# Altium project teclado.PrjPcb (part 1 of 3)
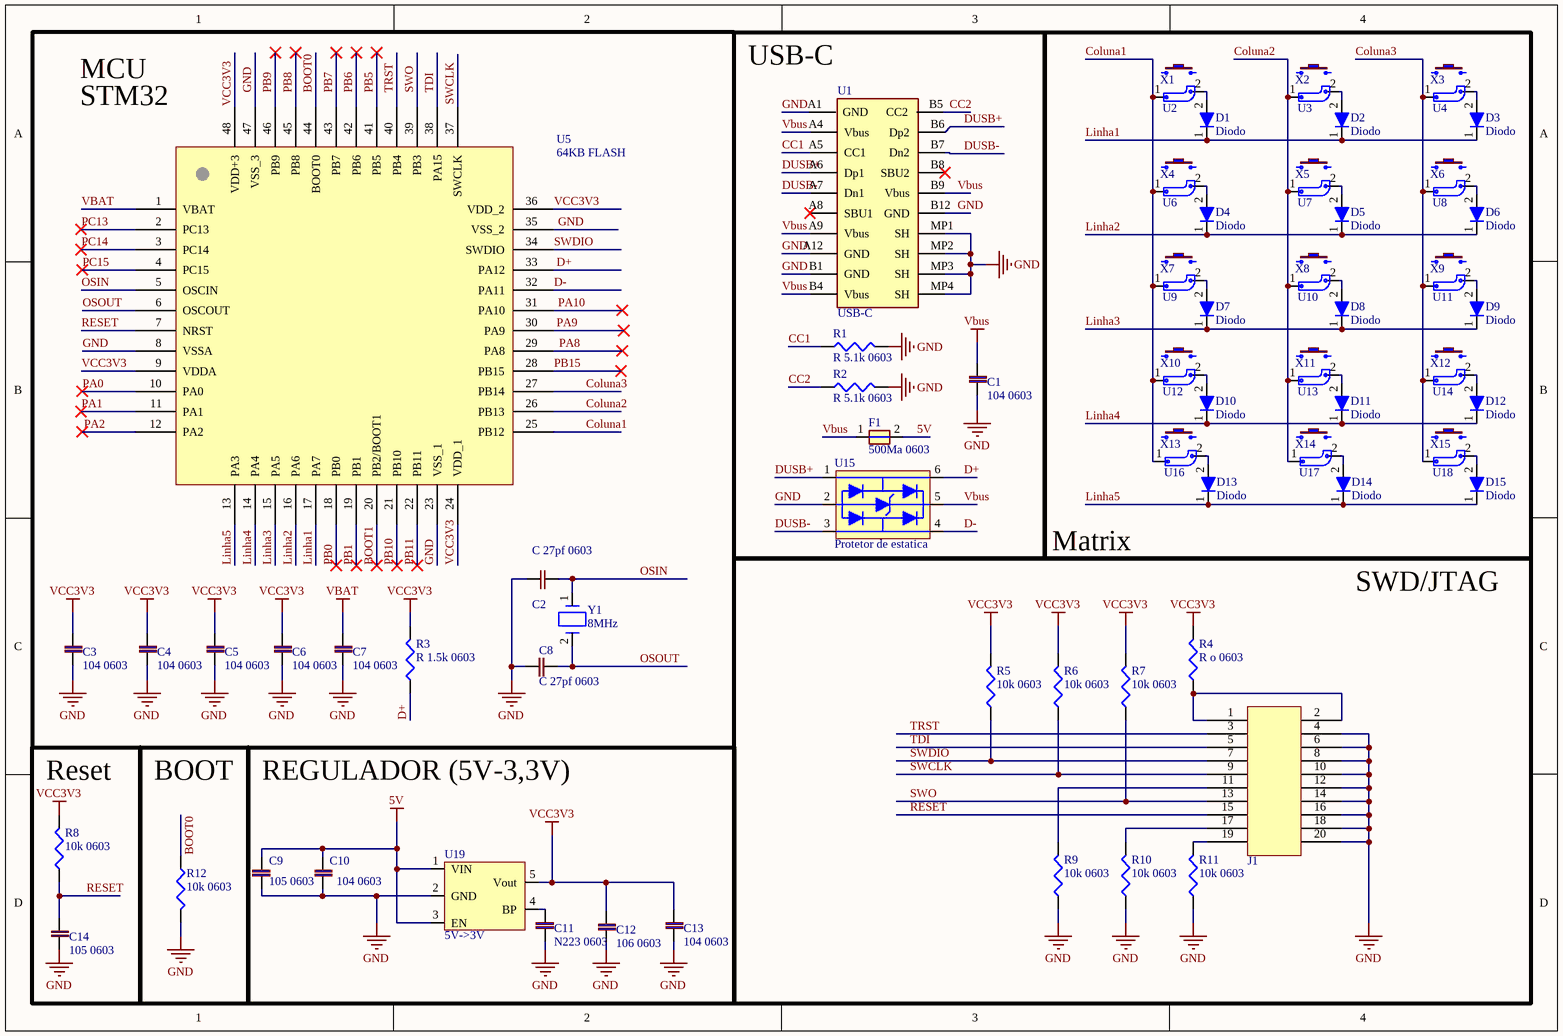
[diagram p0: SqTeclado.SchDoc]
1 sheet, 78 parts. Net scope: global (net labels, ports and power ports of the same name join across sheets).
Board file: PCBtc.PcbDoc

## Sheet SqTeclado.SchDoc
size A4; SheetNumber: 1; SheetTotal: 1

### Parts
C1  104 0603  [Cap 104 0603]
C2  C 27pf 0603  [c 27pf 0603]
C3  104 0603  [Cap 104 0603]
C4  104 0603  [Cap 104 0603]
C5  104 0603  [Cap 104 0603]
C6  104 0603  [Cap 104 0603]
C7  104 0603  [Cap 104 0603]
C8  C 27pf 0603  [c 27pf 0603]
C9  105 0603  [cap 105 0603]
C10  104 0603  [Cap 104 0603]
C11  N223 0603  [cap 223 0603]
C12  106 0603  [cap 106 0603]
C13  104 0603  [Cap 104 0603]
C14  105 0603  [cap 105 0603]
D1  Diodo  [Diodo C]
D2  Diodo  [Diodo C]
D3  Diodo  [Diodo C]
D4  Diodo  [Diodo C]
D5  Diodo  [Diodo C]
D6  Diodo  [Diodo C]
D7  Diodo  [Diodo C]
D8  Diodo  [Diodo C]
D9  Diodo  [Diodo C]
D10  Diodo  [Diodo C]
D11  Diodo  [Diodo C]
D12  Diodo  [Diodo C]
D13  Diodo  [Diodo C]
D14  Diodo  [Diodo C]
D15  Diodo  [Diodo C]
F1  500Ma 0603  [F 500ma 0603]
J1  70247-2051  [Conector 20 pinos angulado p/ programação]  (value not drawn)
R1  R 5.1k 0603  [R 5.1k 0603]
R2  R 5.1k 0603  [R 5.1k 0603]
R3  R 1.5k 0603  [R 1.5k 0603]
R4  R o 0603  [R 0 0603]
R5  10k 0603  [Resistor 10k 0603]
R6  10k 0603  [Resistor 10k 0603]
R7  10k 0603  [Resistor 10k 0603]
R8  10k 0603  [Resistor 10k 0603]
R9  10k 0603  [Resistor 10k 0603]
R10  10k 0603  [Resistor 10k 0603]
R11  10k 0603  [Resistor 10k 0603]
R12  10k 0603  [Resistor 10k 0603]
U1  USB-C  [USB-C]
U2  suporte hot-swap  [Suporte Hot-Swap]  (value not drawn)
U3  suporte hot-swap  [Suporte Hot-Swap]  (value not drawn)
U4  suporte hot-swap  [Suporte Hot-Swap]  (value not drawn)
U5  64KB FLASH  [STM32F103C8T6]
U6  suporte hot-swap  [Suporte Hot-Swap]  (value not drawn)
U7  suporte hot-swap  [Suporte Hot-Swap]  (value not drawn)
U8  suporte hot-swap  [Suporte Hot-Swap]  (value not drawn)
U9  suporte hot-swap  [Suporte Hot-Swap]  (value not drawn)
U10  suporte hot-swap  [Suporte Hot-Swap]  (value not drawn)
U11  suporte hot-swap  [Suporte Hot-Swap]  (value not drawn)
U12  suporte hot-swap  [Suporte Hot-Swap]  (value not drawn)
U13  suporte hot-swap  [Suporte Hot-Swap]  (value not drawn)
U14  suporte hot-swap  [Suporte Hot-Swap]  (value not drawn)
U15  Protetor de estatica  [Potege estatica]
U16  suporte hot-swap  [Suporte Hot-Swap]  (value not drawn)
U17  suporte hot-swap  [Suporte Hot-Swap]  (value not drawn)
U18  suporte hot-swap  [Suporte Hot-Swap]  (value not drawn)
U19  5V->3V  [Regulador 5v->3v]
X1  switch  [tecla]  (value not drawn)
X2  switch  [tecla]  (value not drawn)
X3  switch  [tecla]  (value not drawn)
X4  switch  [tecla]  (value not drawn)
X5  switch  [tecla]  (value not drawn)
X6  switch  [tecla]  (value not drawn)
X7  switch  [tecla]  (value not drawn)
X8  switch  [tecla]  (value not drawn)
X9  switch  [tecla]  (value not drawn)
X10  switch  [tecla]  (value not drawn)
X11  switch  [tecla]  (value not drawn)
X12  switch  [tecla]  (value not drawn)
X13  switch  [tecla]  (value not drawn)
X14  switch  [tecla]  (value not drawn)
X15  switch  [tecla]  (value not drawn)
Y1  8MHz  [Cristal 8MHz]

### Blocks framed on the sheet
USB-C: C1 F1 R1 R2 U1 U15
Matrix: D1-D15 U2-U4 U6-U14 U16-U18 X1-X15
SWD/JTAG: J1 R4-R7 R9-R11
Reset: C14 R8
BOOT: R12
REGULADOR (5V-3,3V): C9-C13 U19

### Nets
5V: C9.1 C10.2 F1.2 U19.1(VIN) U19.3(EN)
GND: C1.1 C2.1 C3.1 C4.1 C5.1 C6.1 C7.1 C8.1 C9.2 C10.1 C11.2 C12.1 C13.1 C14.1 J1.4 J1.6 J1.8 J1.10 J1.12 J1.14 J1.16 J1.18 J1.20 R1.2 R2.2 R9.1 R10.1 R11.1 R12.2 U1.A1(GND) U1.A12(GND) U1.B1(GND) U1.B12(GND) U1.MP1(SH) U1.MP2(SH) U1.MP3(SH) U1.MP4(SH) U5.8(VSSA) U5.23(VSS_1) U5.35(VSS_2) U5.47(VSS_3) U15.2 U19.2(GND)
VBAT: C7.2 U5.1(VBAT)
Vbus: C1.2 F1.1 U1.A4(Vbus) U1.A9(Vbus) U1.B4(Vbus) U1.B9(Vbus) U15.5
VCC3V3: C3.2 C4.2 C5.2 C6.2 C12.2 C13.2 R3.2 R4.2 R5.2 R6.2 R7.2 R8.2 U5.9(VDDA) U5.24(VDD_1) U5.36(VDD_2) U5.48(VDD+3) U19.5(Vout)
BOOT0: R12.1 U5.44(BOOT0)
BOOT1: U5.20(PB2/BOOT1)
CC1: R1.1 U1.A5(CC1)
CC2: R2.1 U1.B5(CC2)
Coluna1: U2.1 U5.25(PB12) U6.1 U9.1 U12.1 U16.1
Coluna2: U3.1 U5.26(PB13) U7.1 U10.1 U13.1 U17.1
Coluna3: U4.1 U5.27(PB14) U8.1 U11.1 U14.1 U18.1
D+: R3.1 U5.33(PA12) U15.6
D-: U5.32(PA11) U15.4
DUSB+: U1.A6(Dp1) U1.B6(Dp2) U15.1
DUSB-: U1.A7(Dn1) U1.B7(Dn2) U15.3
Linha1: D1.1 D2.1 D3.1 U5.17(PA7)
Linha2: D4.1 D5.1 D6.1 U5.16(PA6)
Linha3: D7.1 D8.1 D9.1 U5.15(PA5)
Linha4: D10.1 D11.1 D12.1 U5.14(PA4)
Linha5: D13.1 D14.1 D15.1 U5.13(PA3)
OSIN: C2.2 U5.5(OSCIN) Y1.1
OSOUT: C8.2 U5.6(OSCOUT) Y1.2
PA0: U5.10(PA0)
PA1: U5.11(PA1)
PA2: U5.12(PA2)
PA8: U5.29(PA8)
PA9: U5.30(PA9)
PA10: U5.31(PA10)
PB0: U5.18(PB0)
PB1: U5.19(PB1)
PB5: U5.41(PB5)
PB6: U5.42(PB6)
PB7: U5.43(PB7)
PB8: U5.45(PB8)
PB9: U5.46(PB9)
PB10: U5.21(PB10)
PB11: U5.22(PB11)
PB15: U5.28(PB15)
PC13: U5.2(PC13)
PC14: U5.3(PC14)
PC15: U5.4(PC15)
RESET: C14.2 J1.15 R8.1 U5.7(NRST)
SWCLK: J1.9 R6.1 U5.37(SWCLK)
SWDIO: J1.7 R5.1 U5.34(SWDIO)
SWO: J1.13 R7.1 U5.39(PB3)
TDI: J1.5 U5.38(PA15)
TRST: J1.3 U5.40(PB4)
NetC11_1: C11.1 U19.4(BP)
NetD1_2: D1.2 U2.2
NetD2_2: D2.2 U3.2
NetD3_2: D3.2 U4.2
NetD4_2: D4.2 U6.2
NetD5_2: D5.2 U7.2
NetD6_2: D6.2 U8.2
NetD7_2: D7.2 U9.2
NetD8_2: D8.2 U10.2
NetD9_2: D9.2 U11.2
NetD10_2: D10.2 U12.2
NetD11_2: D11.2 U13.2
NetD12_2: D12.2 U14.2
NetD13_2: D13.2 U16.2
NetD14_2: D14.2 U17.2
NetD15_2: D15.2 U18.2
NetJ1_1: J1.1 J1.2 R4.1
NetJ1_11: J1.11 R9.2
NetJ1_17: J1.17 R10.2
NetJ1_19: J1.19 R11.2

Not connected (* = marked no-connect by the designer): U1 A8(SBU1)* B8(SBU2)*

### Notes on the sheet
- (near U5) STM32
- MCU